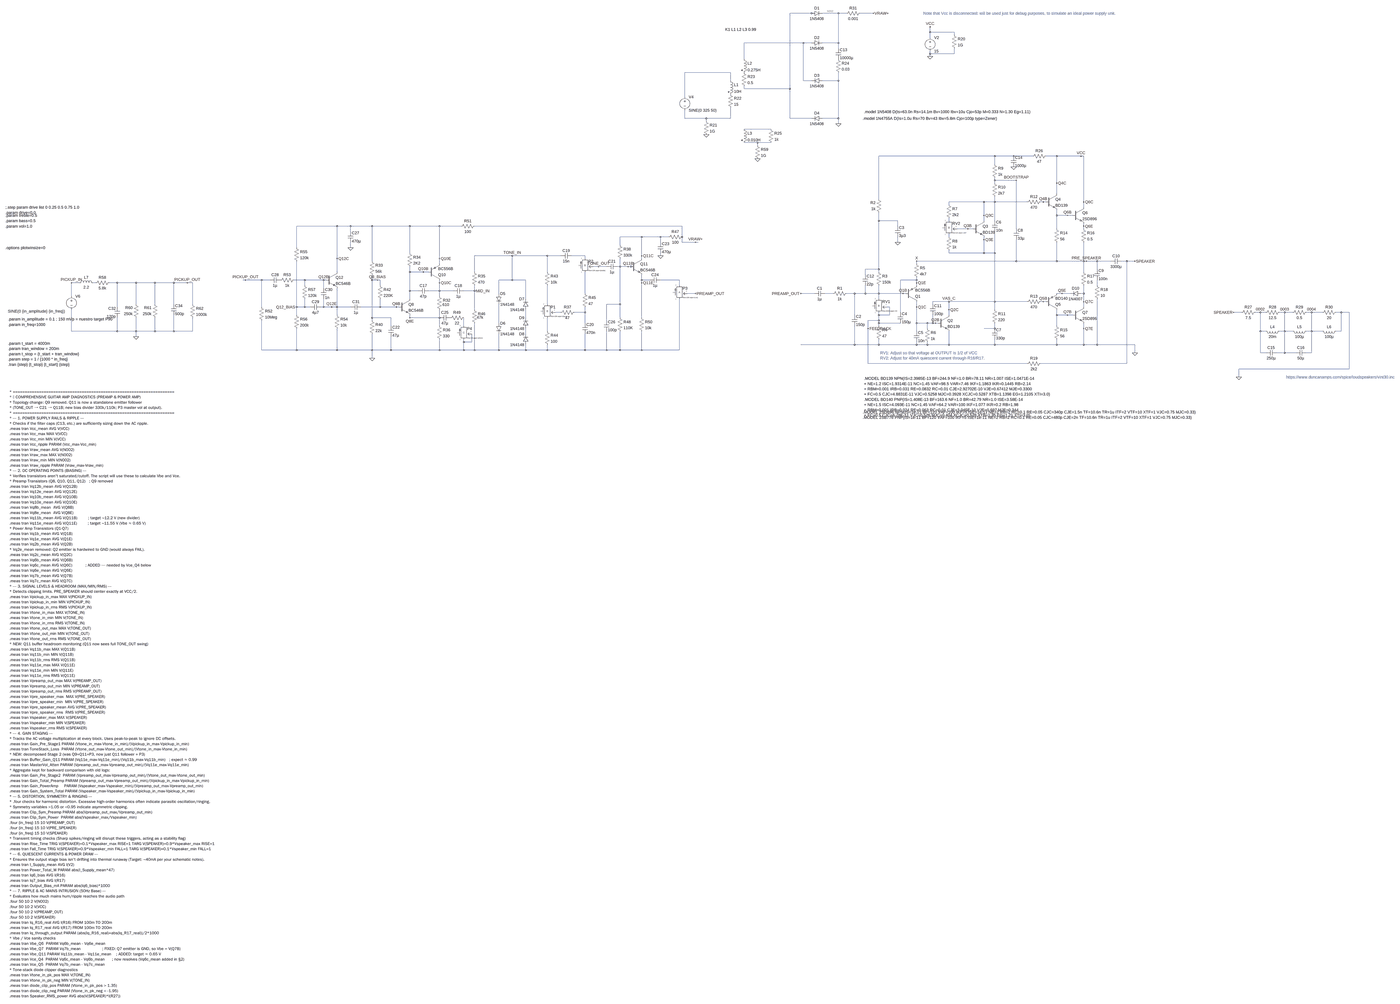
[diagram p0: schematic AudioAmpCompl-40W.asc, whole sheet]
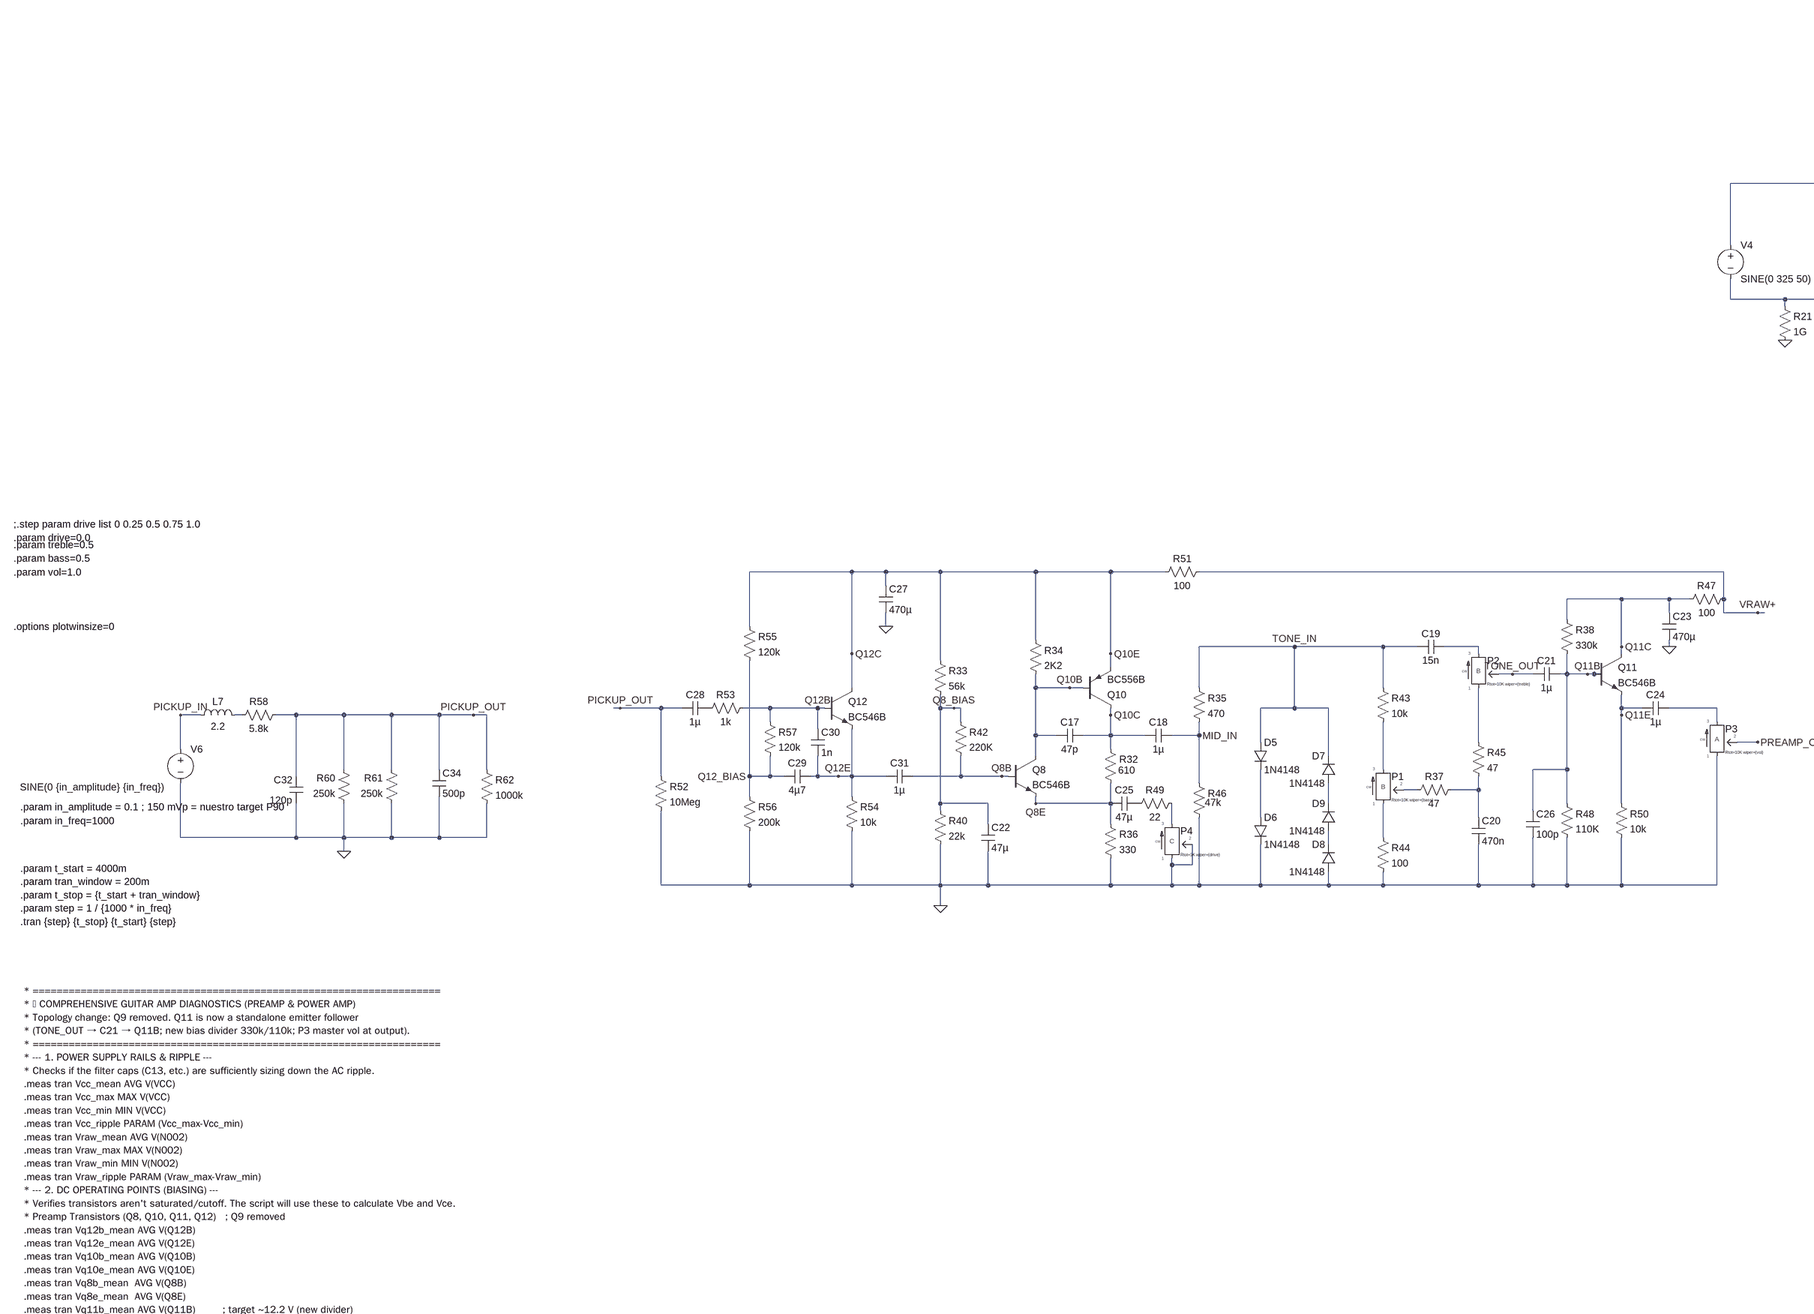
[diagram p1: schematic AudioAmpCompl-40W.asc, part, row 1 of 2, column 1 of 2]
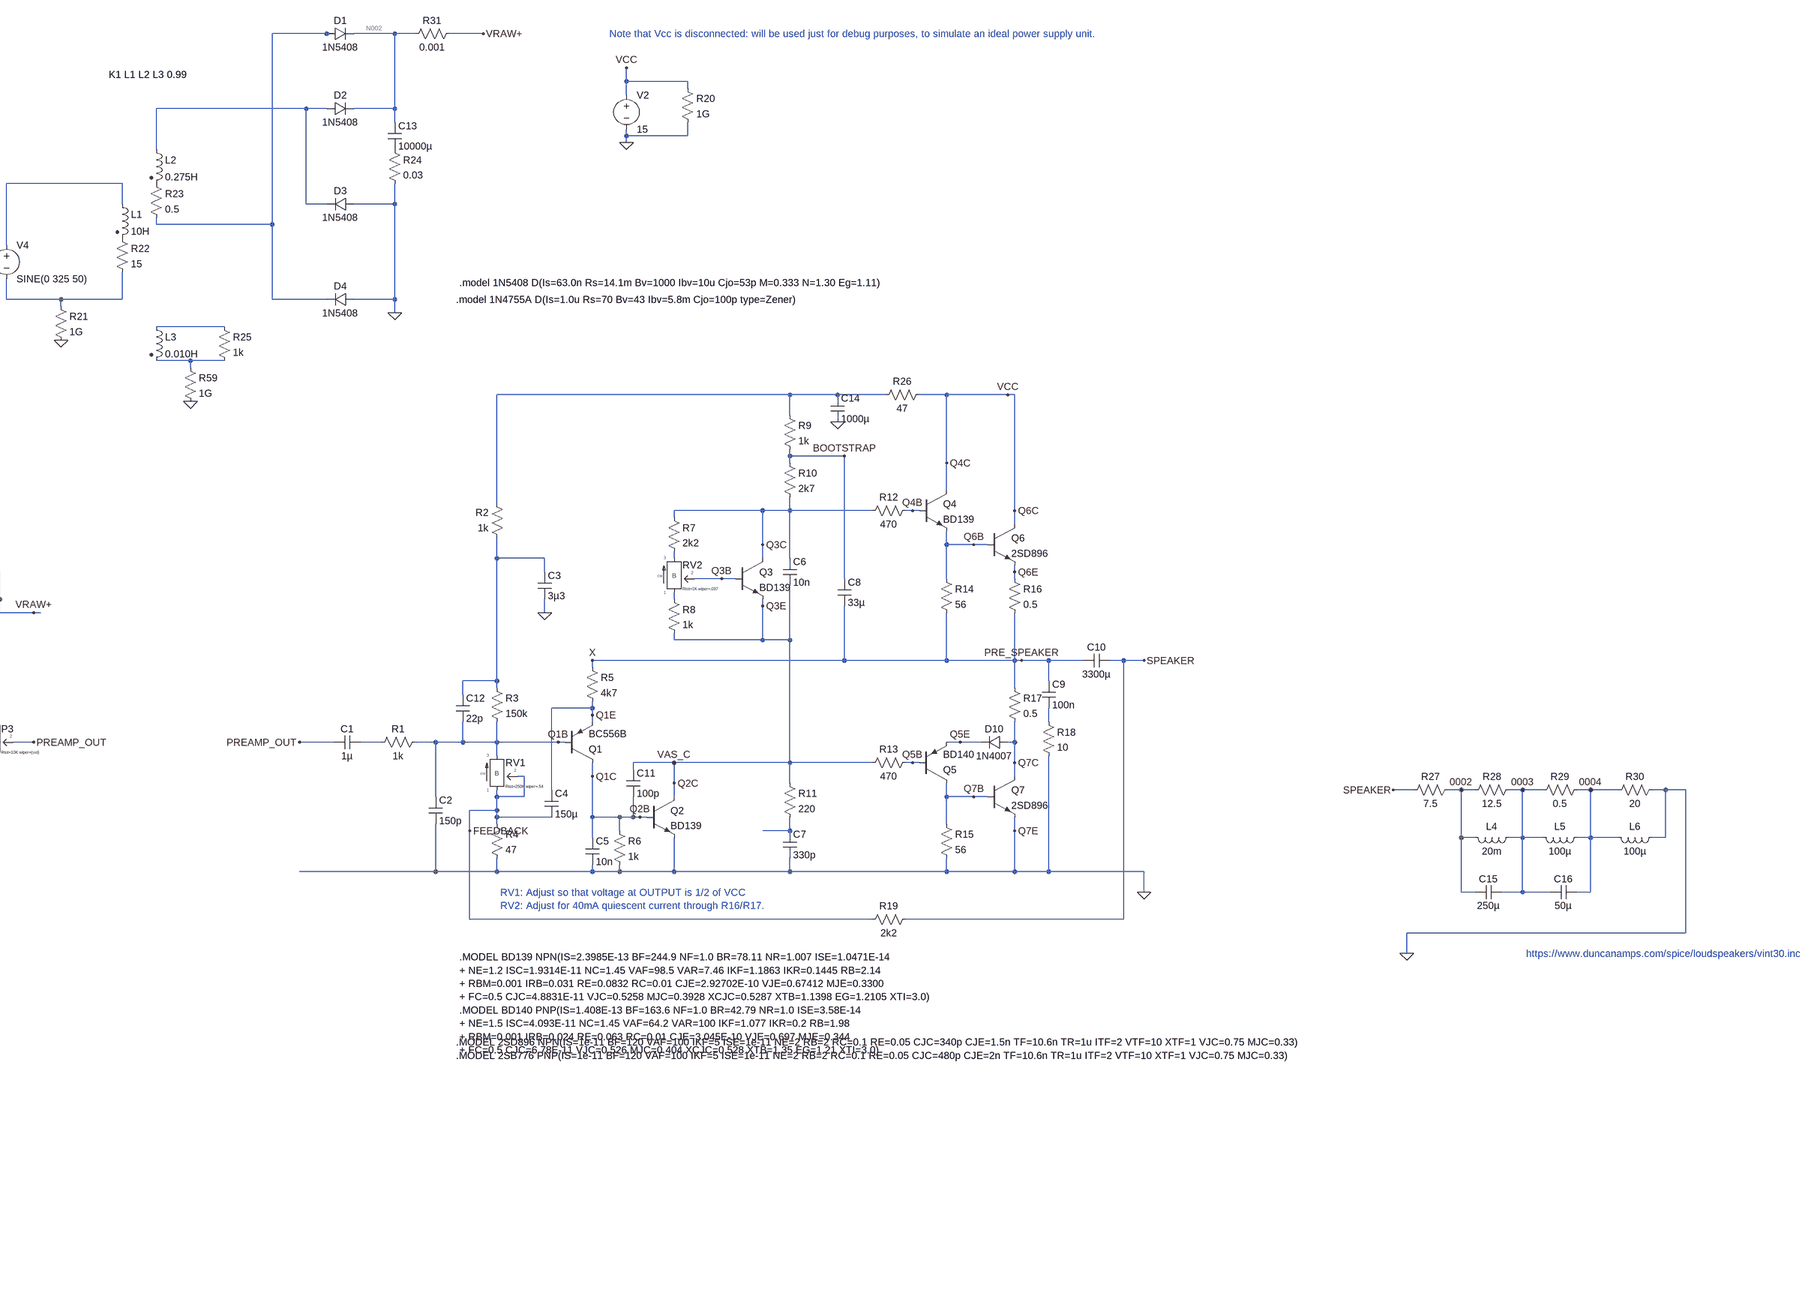
[diagram p2: schematic AudioAmpCompl-40W.asc, part, row 1 of 2, column 2 of 2]
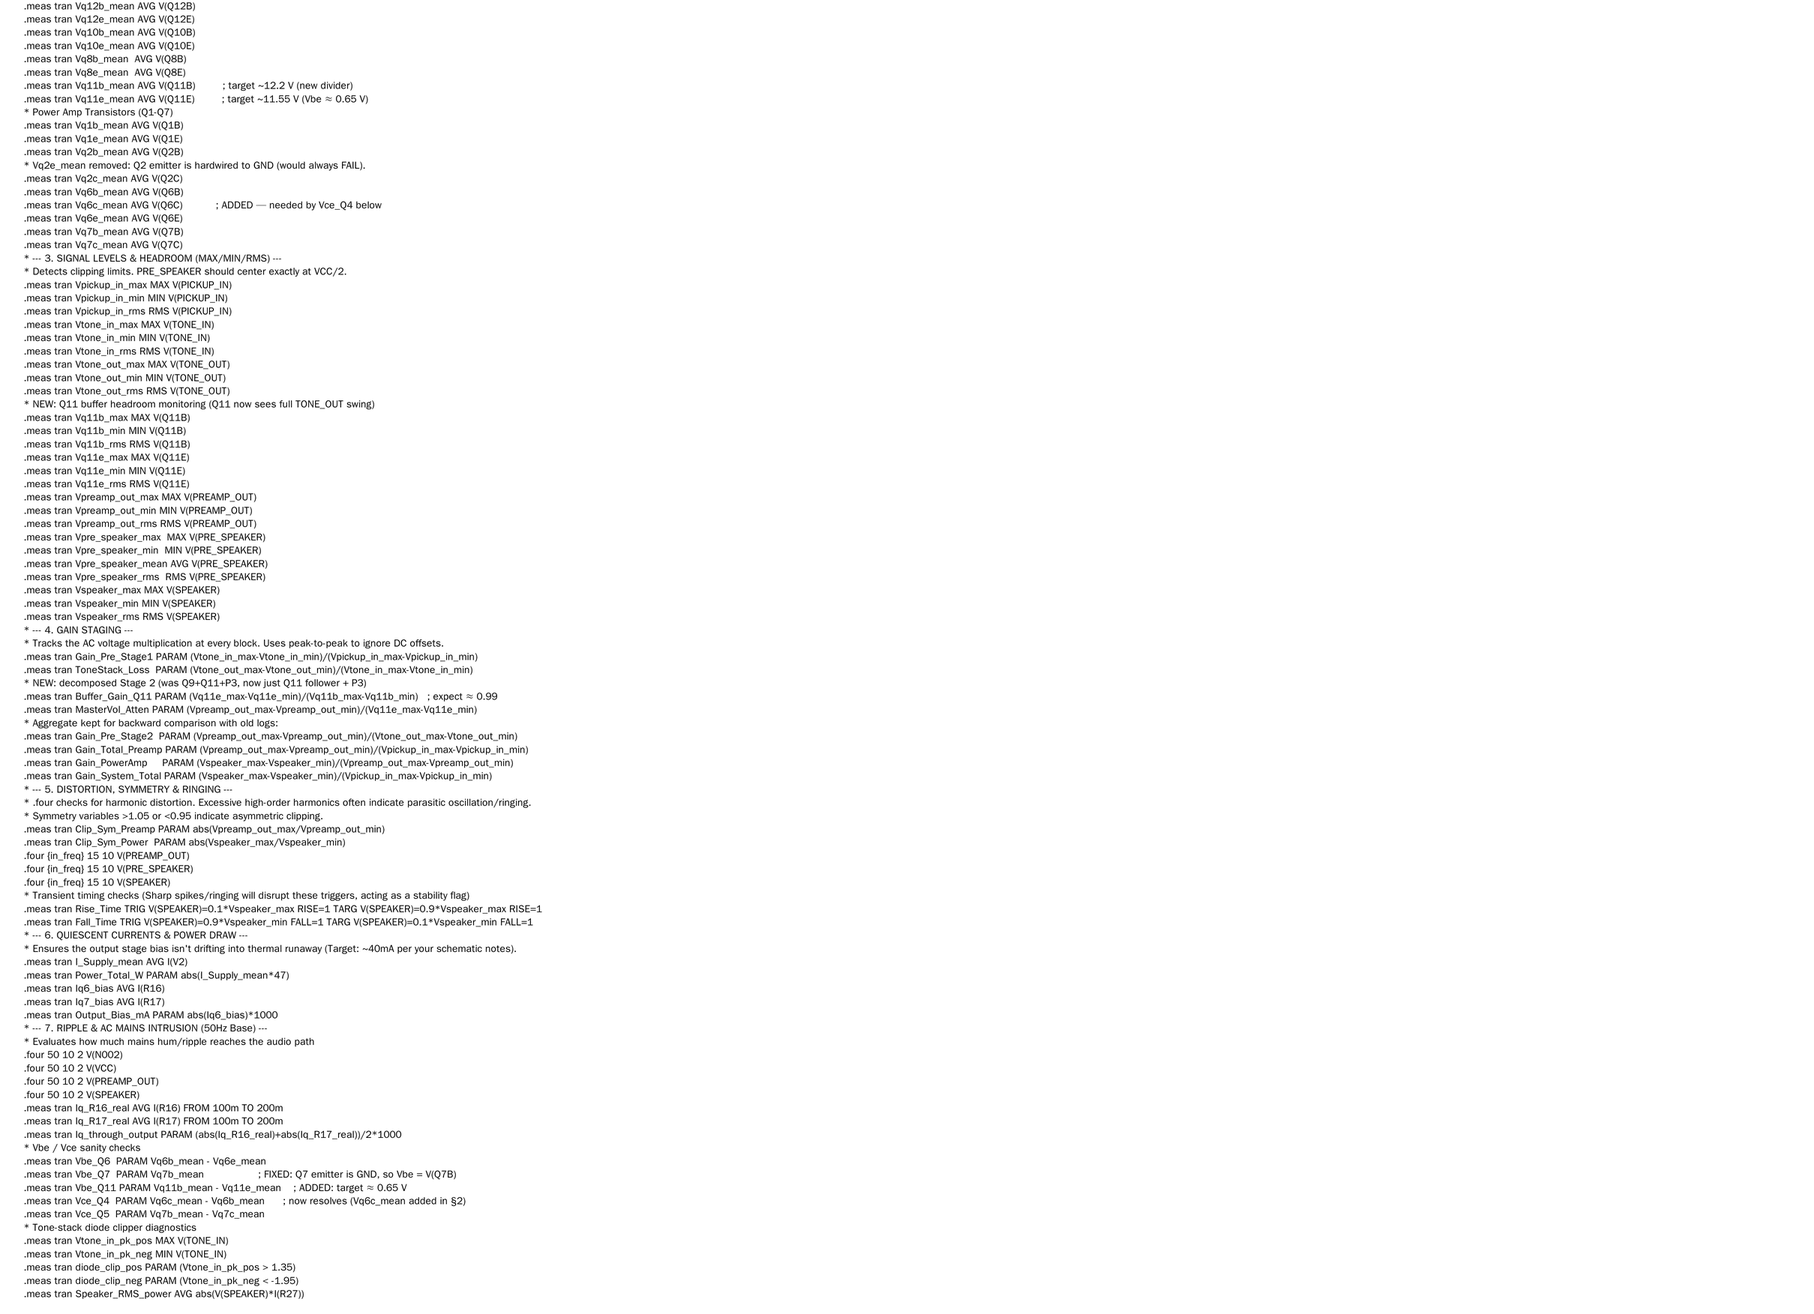
[diagram p3: schematic AudioAmpCompl-40W.asc, part, row 2 of 2, column 1 of 2]
AudioAmpCompl-40W.asc, the LTspice schematic file:
Version 4
SHEET 1 6900 5928
WIRE 3408 1136 3280 1136
WIRE 3424 1136 3408 1136
WIRE 3568 1136 3472 1136
WIRE 3616 1136 3568 1136
WIRE 3776 1136 3696 1136
WIRE 4112 1248 4112 1216
WIRE 4256 1248 4112 1248
WIRE 4256 1264 4256 1248
WIRE 4112 1280 4112 1248
WIRE 3360 1312 3008 1312
WIRE 3408 1312 3360 1312
WIRE 3568 1312 3568 1136
WIRE 3568 1312 3472 1312
WIRE 3568 1344 3568 1312
WIRE 4112 1376 4112 1360
WIRE 4256 1376 4256 1344
WIRE 4256 1376 4112 1376
WIRE 4112 1392 4112 1376
WIRE 3008 1408 3008 1312
WIRE 2928 1488 2656 1488
WIRE 2928 1536 2928 1488
WIRE 3360 1536 3360 1312
WIRE 3408 1536 3360 1536
WIRE 3568 1536 3568 1488
WIRE 3568 1536 3472 1536
WIRE 3008 1584 3008 1568
WIRE 3280 1584 3280 1136
WIRE 3280 1584 3008 1584
WIRE 2656 1632 2656 1488
WIRE 2656 1760 2656 1712
WIRE 2784 1760 2656 1760
WIRE 2928 1760 2928 1696
WIRE 2928 1760 2784 1760
WIRE 3280 1760 3280 1584
WIRE 3408 1760 3280 1760
WIRE 3568 1760 3568 1536
WIRE 3568 1760 3472 1760
WIRE 2784 1776 2784 1760
WIRE 3568 1792 3568 1760
WIRE 3168 1824 3008 1824
WIRE 3088 1904 3008 1904
WIRE 3168 1904 3088 1904
WIRE 3088 1920 3088 1904
WIRE 4496 1984 3808 1984
WIRE 4608 1984 4496 1984
WIRE 4720 1984 4608 1984
WIRE 4864 1984 4800 1984
WIRE 5008 1984 4864 1984
WIRE 5024 1984 5008 1984
WIRE 4496 2032 4496 1984
WIRE 4496 2128 4496 2112
WIRE 4624 2128 4496 2128
WIRE 4496 2144 4496 2128
WIRE 4864 2144 4864 1984
WIRE 4864 2208 4864 2144
WIRE 3808 2240 3808 1984
WIRE 4432 2256 4224 2256
WIRE 4496 2256 4496 2224
WIRE 4496 2256 4432 2256
WIRE 4688 2256 4496 2256
WIRE 4784 2256 4768 2256
WIRE 4800 2256 4784 2256
WIRE 5024 2256 5024 1984
WIRE 4224 2272 4224 2256
WIRE 5024 2288 5024 2256
WIRE 4432 2336 4432 2256
WIRE 4864 2336 4864 2304
WIRE 4928 2336 4864 2336
WIRE 4960 2336 4928 2336
WIRE 3808 2368 3808 2320
WIRE 3920 2368 3808 2368
WIRE 4224 2368 4224 2352
WIRE 4432 2368 4432 2336
WIRE 4496 2368 4496 2256
WIRE 592 2400 352 2400
WIRE 672 2400 592 2400
WIRE 800 2400 672 2400
WIRE 1024 2400 800 2400
WIRE 1200 2400 1024 2400
WIRE 1328 2400 1200 2400
WIRE 2640 2400 1408 2400
WIRE 3920 2400 3920 2368
WIRE 5024 2400 5024 2384
WIRE 4336 2416 4272 2416
WIRE 4368 2416 4336 2416
WIRE 4624 2416 4624 2128
WIRE 4864 2416 4864 2336
WIRE 5024 2416 5024 2400
WIRE 672 2432 672 2400
WIRE 2400 2464 2272 2464
WIRE 2512 2464 2400 2464
WIRE 2560 2464 2512 2464
WIRE 2640 2464 2640 2400
WIRE 4224 2464 4224 2448
WIRE 4432 2480 4432 2464
WIRE 2512 2496 2512 2464
WIRE 2640 2496 2640 2464
WIRE 2720 2496 2640 2496
WIRE 2736 2496 2720 2496
WIRE 3920 2496 3920 2464
WIRE 2272 2512 2272 2464
WIRE 352 2528 352 2400
WIRE 672 2528 672 2496
WIRE 1024 2560 1024 2400
WIRE 4224 2560 4224 2544
WIRE 4432 2560 4432 2480
WIRE 4432 2560 4224 2560
WIRE 4496 2560 4496 2432
WIRE 4496 2560 4432 2560
WIRE 1632 2576 1408 2576
WIRE 1840 2576 1632 2576
WIRE 1920 2576 1840 2576
WIRE 2064 2576 1984 2576
WIRE 2400 2576 2400 2464
WIRE 2512 2576 2512 2560
WIRE 592 2592 592 2400
WIRE 1200 2592 1200 2400
WIRE 2064 2592 2064 2576
WIRE 2400 2592 2400 2576
WIRE 800 2608 800 2400
WIRE 4624 2608 4624 2480
WIRE 4624 2608 4032 2608
WIRE 4864 2608 4864 2496
WIRE 4864 2608 4624 2608
WIRE 5024 2608 5024 2496
WIRE 5024 2608 4864 2608
WIRE 5040 2608 5024 2608
WIRE 5104 2608 5040 2608
WIRE 5184 2608 5104 2608
WIRE 5280 2608 5248 2608
WIRE 5328 2608 5280 2608
WIRE 1200 2624 1200 2592
WIRE 4032 2624 4032 2608
WIRE 2144 2640 2112 2640
WIRE 2192 2640 2144 2640
WIRE 2272 2640 2272 2592
WIRE 2272 2640 2256 2640
WIRE 2320 2640 2272 2640
WIRE 2336 2640 2320 2640
WIRE 2352 2640 2336 2640
WIRE 3808 2656 3808 2368
WIRE 3808 2656 3728 2656
WIRE 5104 2656 5104 2608
WIRE 592 2672 592 2592
WIRE 1024 2672 1024 2640
WIRE 1104 2672 1024 2672
WIRE 1136 2672 1104 2672
WIRE 1408 2672 1408 2576
WIRE 1840 2672 1840 2576
WIRE 3808 2672 3808 2656
WIRE 5024 2672 5024 2608
WIRE 3728 2688 3728 2656
WIRE 48 2720 32 2720
WIRE 144 2720 48 2720
WIRE 192 2720 144 2720
WIRE 400 2720 336 2720
WIRE 512 2720 400 2720
WIRE 528 2720 512 2720
WIRE 800 2720 800 2688
WIRE 832 2720 800 2720
WIRE 848 2720 832 2720
WIRE 1632 2720 1632 2576
WIRE 1632 2720 1552 2720
WIRE 1712 2720 1632 2720
WIRE 2400 2720 2400 2688
WIRE 2448 2720 2400 2720
WIRE 2624 2720 2512 2720
WIRE 4032 2720 4032 2704
WIRE 4032 2720 3936 2720
WIRE -944 2736 -992 2736
WIRE -848 2736 -864 2736
WIRE -720 2736 -768 2736
WIRE -608 2736 -720 2736
WIRE -496 2736 -608 2736
WIRE -384 2736 -496 2736
WIRE -304 2736 -384 2736
WIRE -272 2736 -304 2736
WIRE 1200 2736 1200 2720
WIRE 2400 2736 2400 2720
WIRE 4032 2736 4032 2720
WIRE 400 2752 400 2720
WIRE 848 2752 848 2720
WIRE 2624 2752 2624 2720
WIRE 4032 2752 4032 2736
WIRE 5104 2752 5104 2720
WIRE 512 2768 512 2720
WIRE 1024 2784 1024 2672
WIRE 1072 2784 1024 2784
WIRE 1200 2784 1200 2736
WIRE 1200 2784 1136 2784
WIRE 1280 2784 1200 2784
WIRE 1408 2784 1408 2752
WIRE 1408 2784 1344 2784
WIRE 1552 2800 1552 2720
WIRE 2064 2800 2064 2672
WIRE 2720 2800 2672 2800
WIRE 3424 2800 3344 2800
WIRE 3536 2800 3488 2800
WIRE 3664 2800 3616 2800
WIRE 3728 2800 3728 2752
WIRE 3728 2800 3664 2800
WIRE 3808 2800 3808 2752
WIRE 3808 2800 3728 2800
WIRE 3952 2800 3808 2800
WIRE 3968 2800 3952 2800
WIRE 4896 2800 4864 2800
WIRE 4944 2800 4896 2800
WIRE 5024 2800 5024 2752
WIRE 5024 2800 5008 2800
WIRE -992 2816 -992 2736
WIRE 1200 2816 1200 2784
WIRE 1024 2832 1024 2784
WIRE 1712 2832 1712 2720
WIRE 3808 2832 3808 2800
WIRE 4224 2848 4128 2848
WIRE 4496 2848 4496 2560
WIRE 4496 2848 4224 2848
WIRE 4688 2848 4496 2848
WIRE 4784 2848 4768 2848
WIRE 4800 2848 4784 2848
WIRE 5024 2848 5024 2800
WIRE -608 2864 -608 2736
WIRE -496 2864 -496 2736
WIRE -384 2864 -384 2736
WIRE -272 2864 -272 2736
WIRE 1840 2864 1840 2752
WIRE 2272 2864 2272 2640
WIRE 2272 2864 2192 2864
WIRE 4128 2864 4128 2848
WIRE -720 2880 -720 2736
WIRE 144 2880 144 2720
WIRE 352 2880 352 2608
WIRE 400 2880 400 2832
WIRE 400 2880 352 2880
WIRE 432 2880 400 2880
WIRE 512 2880 512 2832
WIRE 512 2880 496 2880
WIRE 560 2880 512 2880
WIRE 592 2880 592 2768
WIRE 592 2880 560 2880
WIRE 672 2880 592 2880
WIRE 848 2880 848 2832
WIRE 848 2880 736 2880
WIRE 944 2880 848 2880
WIRE 960 2880 944 2880
WIRE 3872 2880 3856 2880
WIRE 4032 2880 4032 2848
WIRE 5024 2880 5024 2848
WIRE 1408 2896 1408 2784
WIRE 4224 2896 4224 2848
WIRE 4496 2896 4496 2848
WIRE 1920 2912 1888 2912
WIRE 2064 2912 2064 2880
WIRE 2064 2912 2000 2912
WIRE 3936 2912 3936 2720
WIRE 5968 2912 5920 2912
WIRE 6080 2912 6048 2912
WIRE 6112 2912 6080 2912
WIRE 6224 2912 6192 2912
WIRE 6272 2912 6224 2912
WIRE 6384 2912 6352 2912
WIRE 6448 2912 6384 2912
WIRE 6560 2912 6528 2912
WIRE 6608 2912 6560 2912
WIRE 352 2928 352 2880
WIRE 592 2928 592 2880
WIRE 3664 2928 3664 2800
WIRE 3808 2928 3808 2912
WIRE 3872 2928 3872 2880
WIRE 3872 2928 3808 2928
WIRE 4224 2928 4224 2896
WIRE 4864 2928 4864 2896
WIRE 4928 2928 4864 2928
WIRE 4960 2928 4928 2928
WIRE 800 2944 800 2720
WIRE 912 2944 800 2944
WIRE 1024 2944 1024 2928
WIRE 1200 2944 1200 2896
WIRE 1200 2944 1024 2944
WIRE 1712 2944 1712 2896
WIRE 2272 2944 2272 2864
WIRE 2400 2944 2400 2736
WIRE 800 2960 800 2944
WIRE 2192 2960 2192 2864
WIRE 3808 2960 3808 2928
WIRE 3808 2960 3744 2960
WIRE 1552 2976 1552 2864
WIRE 2064 2976 2064 2912
WIRE 3808 2976 3808 2960
WIRE 3936 2976 3808 2976
WIRE 4032 2976 4032 2880
WIRE 4096 2976 4032 2976
WIRE 4128 2976 4128 2928
WIRE 4128 2976 4096 2976
WIRE 4144 2976 4128 2976
WIRE 4160 2976 4144 2976
WIRE 912 2992 912 2944
WIRE 1200 2992 1200 2944
WIRE 1344 2992 1344 2944
WIRE 3808 2992 3808 2976
WIRE 4864 2992 4864 2928
WIRE 3744 3008 3744 2960
WIRE 4096 3008 4096 2976
WIRE 4496 3008 4496 2976
WIRE 4496 3008 4432 3008
WIRE 5024 3008 5024 2976
WIRE -992 3024 -992 2896
WIRE -720 3024 -720 2944
WIRE -720 3024 -992 3024
WIRE -608 3024 -608 2944
WIRE -608 3024 -720 3024
WIRE -496 3024 -496 2944
WIRE -496 3024 -608 3024
WIRE -384 3024 -384 2928
WIRE -384 3024 -496 3024
WIRE -272 3024 -272 2944
WIRE -272 3024 -384 3024
WIRE 1840 3024 1840 2944
WIRE 4032 3024 4032 2976
WIRE 6080 3024 6080 2912
WIRE 6112 3024 6080 3024
WIRE 6224 3024 6224 2912
WIRE 6224 3024 6192 3024
WIRE 6272 3024 6224 3024
WIRE 6384 3024 6384 2912
WIRE 6384 3024 6352 3024
WIRE 6448 3024 6384 3024
WIRE 6560 3024 6560 2912
WIRE 6560 3024 6528 3024
WIRE 1712 3040 1712 3008
WIRE -608 3056 -608 3024
WIRE 1344 3088 1344 3072
WIRE 1392 3088 1392 3040
WIRE 1392 3088 1344 3088
WIRE 3664 3104 3664 2992
WIRE 3664 3104 3344 3104
WIRE 3808 3104 3808 3072
WIRE 3808 3104 3664 3104
WIRE 4032 3104 4032 3088
WIRE 4032 3104 3808 3104
WIRE 4096 3104 4096 3088
WIRE 4096 3104 4032 3104
WIRE 4224 3104 4224 3024
WIRE 4224 3104 4096 3104
WIRE 4496 3104 4496 3072
WIRE 4496 3104 4224 3104
WIRE 4864 3104 4864 3072
WIRE 4864 3104 4496 3104
WIRE 5024 3104 5024 3008
WIRE 5024 3104 4864 3104
WIRE 5104 3104 5104 2832
WIRE 5104 3104 5024 3104
WIRE 5328 3104 5104 3104
WIRE 144 3136 144 2960
WIRE 352 3136 352 3008
WIRE 352 3136 144 3136
WIRE 592 3136 592 3008
WIRE 592 3136 352 3136
WIRE 800 3136 800 3040
WIRE 800 3136 592 3136
WIRE 912 3136 912 3056
WIRE 912 3136 800 3136
WIRE 1200 3136 1200 3072
WIRE 1200 3136 912 3136
WIRE 1344 3136 1344 3088
WIRE 1344 3136 1200 3136
WIRE 1408 3136 1408 2976
WIRE 1408 3136 1344 3136
WIRE 1552 3136 1552 3040
WIRE 1552 3136 1408 3136
WIRE 1712 3136 1712 3104
WIRE 1712 3136 1552 3136
WIRE 1840 3136 1840 3104
WIRE 1840 3136 1712 3136
WIRE 2064 3136 2064 3040
WIRE 2064 3136 1840 3136
WIRE 2192 3136 2192 3024
WIRE 2192 3136 2064 3136
WIRE 2272 3136 2272 3024
WIRE 2272 3136 2192 3136
WIRE 2400 3136 2400 3024
WIRE 2400 3136 2272 3136
WIRE 2624 3136 2624 2832
WIRE 2624 3136 2400 3136
WIRE 5328 3152 5328 3104
WIRE 6080 3152 6080 3024
WIRE 6112 3152 6080 3152
WIRE 6224 3152 6224 3024
WIRE 6224 3152 6176 3152
WIRE 6288 3152 6224 3152
WIRE 6384 3152 6384 3024
WIRE 6384 3152 6352 3152
WIRE 800 3184 800 3136
WIRE 3744 3216 3744 3008
WIRE 4688 3216 3744 3216
WIRE 5280 3216 5280 2608
WIRE 5280 3216 4768 3216
WIRE 6608 3248 6608 2912
WIRE 6608 3248 5952 3248
WIRE 5952 3296 5952 3248
FLAG 5328 3152 0
FLAG 3920 2496 0
FLAG 4112 1392 0
FLAG 4112 1216 VCC
FLAG 5328 2608 SPEAKER
FLAG 5040 2608 PRE_SPEAKER
FLAG 3344 2800 PREAMP_OUT
FLAG 4624 2128 BOOTSTRAP
FLAG 4224 2848 VAS_C
FLAG 4032 2608 X
FLAG 5008 1984 VCC
FLAG 3568 1792 0
FLAG 4608 2048 0
FLAG 6080 2912 0002
FLAG 6224 2912 0003
FLAG 6384 2912 0004
FLAG 5952 3296 0
FLAG 5920 2912 SPEAKER
FLAG 3776 1136 VRAW+
FLAG 944 2880 Q8B
FLAG 1024 2944 Q8E
FLAG 1200 2736 Q10C
FLAG 1200 2592 Q10E
FLAG 800 3184 0
FLAG -992 2736 PICKUP_IN
FLAG 2512 2576 0
FLAG 1632 2576 TONE_IN
FLAG 1408 2784 MID_IN
FLAG 2400 2736 Q11E
FLAG 2400 2576 Q11C
FLAG 672 2528 0
FLAG 512 2720 Q12B
FLAG 592 2592 Q12C
FLAG 352 2880 Q12_BIAS
FLAG 560 2880 Q12E
FLAG 2144 2640 TONE_OUT
FLAG 2720 2800 PREAMP_OUT
FLAG 2720 2496 VRAW+
FLAG -304 2736 PICKUP_OUT
FLAG 48 2720 PICKUP_OUT
FLAG -608 3056 0
FLAG 1104 2672 Q10B
FLAG 2320 2640 Q11B
FLAG 4144 2976 Q2B
FLAG 4224 2896 Q2C
FLAG 4032 2736 Q1E
FLAG 3952 2800 Q1B
FLAG 4032 2880 Q1C
FLAG 4432 2480 Q3E
FLAG 4336 2416 Q3B
FLAG 4432 2336 Q3C
FLAG 4784 2256 Q4B
FLAG 4864 2144 Q4C
FLAG 5024 2256 Q6C
FLAG 4928 2336 Q6B
FLAG 5024 2400 Q6E
FLAG 5024 2848 Q7C
FLAG 4928 2928 Q7B
FLAG 5024 3008 Q7E
FLAG 4896 2800 Q5E
FLAG 4784 2848 Q5B
FLAG 832 2720 Q8_BIAS
FLAG 3744 3008 FEEDBACK
FLAG 2784 1856 0
FLAG 3088 2000 0
DATAFLAG 800 2720 "round($*100)/100"
DATAFLAG 848 2880 "round($*100)/100"
DATAFLAG 1200 2784 "round($*100)/100"
DATAFLAG 1024 2672 "round($*100)/100"
DATAFLAG 1104 2944 "round($*100)/100"
DATAFLAG 1360 2784 "round($*100)/100"
DATAFLAG 2416 2464 "round($*100)/100"
DATAFLAG 1248 2400 "round($*100)/100"
DATAFLAG 448 2720 "round($*100)/100"
DATAFLAG 592 2832 "round($*100)/100"
DATAFLAG 352 2800 "round($*100)/100"
DATAFLAG 2272 2720 "round($*100)/100"
DATAFLAG 2400 2816 "round($*100)/100"
DATAFLAG 3888 2368 "round($*100)/100"
DATAFLAG 3808 2000 "round($*100)/100"
DATAFLAG 3888 2800 "round($*100)/100"
DATAFLAG 3872 2976 "round($*100)/100"
DATAFLAG 4496 2128 "round($*100)/100"
DATAFLAG 4416 2256 "round($*100)/100"
DATAFLAG 4336 2560 "round($*100)/100"
DATAFLAG 4560 2608 "round($*100)/100"
DATAFLAG 4560 2848 "round($*100)/100"
DATAFLAG 4432 3008 "round($*100)/100"
DATAFLAG 4864 2384 "round($*100)/100"
DATAFLAG 4864 2544 "round($*100)/100"
DATAFLAG 5024 2544 "round($*100)/100"
DATAFLAG 5024 2768 "round($*100)/100"
SYMBOL npn 4960 2288 R0
SYMATTR InstName Q6
SYMATTR Value 2SD896
SYMBOL npn 4960 2880 R0
SYMATTR InstName Q7
SYMATTR Value 2SD896
SYMBOL res 5008 2400 R0
SYMATTR InstName R16
SYMATTR Value 0.5
SYMBOL res 5008 2656 R0
SYMATTR InstName R17
SYMATTR Value 0.5
SYMBOL npn 4800 2208 R0
SYMATTR InstName Q4
SYMATTR Value BD139
SYMBOL res 4848 2400 R0
SYMATTR InstName R14
SYMATTR Value 56
SYMBOL res 4848 2976 R0
SYMATTR InstName R15
SYMATTR Value 56
SYMBOL pnp 4800 2896 M180
SYMATTR InstName Q5
SYMATTR Value BD140
SYMBOL res 4784 2240 R90
WINDOW 0 0 56 VBottom 2
WINDOW 3 32 56 VTop 2
SYMATTR InstName R12
SYMATTR Value 470
SYMBOL res 4784 2832 R90
WINDOW 0 0 56 VBottom 2
WINDOW 3 32 56 VTop 2
SYMATTR InstName R13
SYMATTR Value 470
SYMBOL npn 4368 2368 R0
SYMATTR InstName Q3
SYMATTR Value BD139
SYMBOL res 4208 2256 R0
SYMATTR InstName R7
SYMATTR Value 2k2
SYMBOL res 4208 2448 R0
SYMATTR InstName R8
SYMATTR Value 1k
SYMBOL cap 4480 2368 R0
SYMATTR InstName C6
SYMATTR Value 10n
SYMBOL res 4480 2128 R0
SYMATTR InstName R10
SYMATTR Value 2k7
SYMBOL res 4480 2016 R0
SYMATTR InstName R9
SYMATTR Value 1k
SYMBOL cap 4608 2416 R0
SYMATTR InstName C8
SYMATTR Value 33µ
SYMBOL cap 5088 2656 R0
SYMATTR InstName C9
SYMATTR Value 100n
SYMBOL res 5088 2736 R0
SYMATTR InstName R18
SYMATTR Value 10
SYMBOL res 4480 2880 R0
SYMATTR InstName R11
SYMATTR Value 220
SYMBOL cap 4480 3008 R0
SYMATTR InstName C7
SYMATTR Value 330p
SYMBOL npn 4160 2928 R0
SYMATTR InstName Q2
SYMATTR Value BD139
SYMBOL res 4080 2992 R0
SYMATTR InstName R6
SYMATTR Value 1k
SYMBOL cap 4016 3024 R0
SYMATTR InstName C5
SYMATTR Value 10n
SYMBOL pnp 3968 2848 M180
SYMATTR InstName Q1
SYMATTR Value BC556B
SYMBOL res 4016 2608 R0
SYMATTR InstName R5
SYMATTR Value 4k7
SYMBOL res 3824 2336 R180
WINDOW 0 36 76 Left 2
WINDOW 3 36 40 Left 2
SYMATTR InstName R2
SYMATTR Value 1k
SYMBOL cap 3904 2400 R0
SYMATTR InstName C3
SYMATTR Value 3µ3
SYMBOL res 3792 2656 R0
SYMATTR InstName R3
SYMATTR Value 150k
SYMBOL res 3792 2976 R0
SYMATTR InstName R4
SYMATTR Value 47
SYMBOL cap 5248 2592 R90
WINDOW 0 0 32 VBottom 2
WINDOW 3 32 32 VTop 2
SYMATTR InstName C10
SYMATTR Value 3300µ
SYMBOL cap 3920 2912 R0
SYMATTR InstName C4
SYMATTR Value 150µ
SYMBOL voltage 4112 1264 R0
WINDOW 123 0 0 Left 0
WINDOW 39 0 0 Left 0
SYMATTR InstName V2
SYMATTR Value 15
SYMBOL cap 3648 2928 R0
SYMATTR InstName C2
SYMATTR Value 150p
SYMBOL cap 3488 2784 R90
WINDOW 0 0 32 VBottom 2
WINDOW 3 32 32 VTop 2
SYMATTR InstName C1
SYMATTR Value 1µ
SYMBOL res 3632 2784 R90
WINDOW 0 0 56 VBottom 2
WINDOW 3 32 56 VTop 2
SYMATTR InstName R1
SYMATTR Value 1k
SYMBOL res 4784 3200 R90
WINDOW 0 0 56 VBottom 2
WINDOW 3 32 56 VTop 2
SYMATTR InstName R19
SYMATTR Value 2k2
SYMBOL Cap 3712 2688 R0
SYMATTR InstName C12
SYMATTR Value 22p
SYMBOL Cap 4112 2864 R0
SYMATTR InstName C11
SYMATTR Value 100p
SYMBOL voltage 2656 1616 R0
SYMATTR InstName V4
SYMATTR Value SINE(0 325 50)
SYMATTR SpiceLine Rser=0.1
SYMBOL ind2 2912 1520 R0
SYMATTR InstName L1
SYMATTR Value 10H
SYMATTR Type ind
SYMBOL ind2 2992 1392 R0
SYMATTR InstName L2
SYMATTR Value 0.275H
SYMATTR Type ind
SYMBOL ind2 2992 1808 R0
SYMATTR InstName L3
SYMATTR Value 0.010H
SYMATTR Type ind
SYMBOL Res 2912 1600 R0
SYMATTR InstName R22
SYMATTR Value 15
SYMBOL Res 2992 1472 R0
SYMATTR InstName R23
SYMATTR Value 0.5
SYMBOL Diode 3408 1152 R270
WINDOW 0 32 32 VTop 2
WINDOW 3 0 32 VBottom 2
SYMATTR InstName D1
SYMATTR Value 1N5408
SYMBOL Diode 3408 1328 R270
WINDOW 0 32 32 VTop 2
WINDOW 3 0 32 VBottom 2
SYMATTR InstName D2
SYMATTR Value 1N5408
SYMBOL Diode 3472 1520 R90
WINDOW 0 0 32 VBottom 2
WINDOW 3 32 32 VTop 2
SYMATTR InstName D3
SYMATTR Value 1N5408
SYMBOL Diode 3472 1744 R90
WINDOW 0 0 32 VBottom 2
WINDOW 3 32 32 VTop 2
SYMATTR InstName D4
SYMATTR Value 1N5408
SYMBOL Cap 3552 1344 R0
SYMATTR InstName C13
SYMATTR Value 10000µ
SYMBOL Res 3552 1392 R0
SYMATTR InstName R24
SYMATTR Value 0.03
SYMBOL Res 3152 1808 R0
SYMATTR InstName R25
SYMATTR Value 1k
SYMBOL Res 4816 1968 R90
WINDOW 0 0 56 VBottom 2
WINDOW 3 32 56 VTop 2
SYMATTR InstName R26
SYMATTR Value 47
SYMBOL Cap 4592 1984 R0
SYMATTR InstName C14
SYMATTR Value 1000µ
SYMBOL res 6064 2896 R90
WINDOW 0 0 56 VBottom 2
WINDOW 3 32 56 VTop 2
SYMATTR InstName R27
SYMATTR Value 7.5
SYMBOL res 6208 2896 R90
WINDOW 0 0 56 VBottom 2
WINDOW 3 32 56 VTop 2
SYMATTR InstName R28
SYMATTR Value 12.5
SYMBOL ind 6208 3008 R90
WINDOW 0 5 56 VBottom 2
WINDOW 3 32 56 VTop 2
SYMATTR InstName L4
SYMATTR Value 20m
SYMBOL cap 6176 3136 R90
WINDOW 0 0 32 VBottom 2
WINDOW 3 32 32 VTop 2
SYMATTR InstName C15
SYMATTR Value 250µ
SYMBOL res 6368 2896 R90
WINDOW 0 0 56 VBottom 2
WINDOW 3 32 56 VTop 2
SYMATTR InstName R29
SYMATTR Value 0.5
SYMBOL cap 6352 3136 R90
WINDOW 0 0 32 VBottom 2
WINDOW 3 32 32 VTop 2
SYMATTR InstName C16
SYMATTR Value 50µ
SYMBOL ind 6368 3008 R90
WINDOW 0 5 56 VBottom 2
WINDOW 3 32 56 VTop 2
SYMATTR InstName L5
SYMATTR Value 100µ
SYMBOL res 6544 2896 R90
WINDOW 0 0 56 VBottom 2
WINDOW 3 32 56 VTop 2
SYMATTR InstName R30
SYMATTR Value 20
SYMBOL ind 6544 3008 R90
WINDOW 0 5 56 VBottom 2
WINDOW 3 32 56 VTop 2
SYMATTR InstName L6
SYMATTR Value 100µ
SYMBOL Res 3712 1120 R90
WINDOW 0 0 56 VBottom 2
WINDOW 3 32 56 VTop 2
SYMATTR InstName R31
SYMATTR Value 0.001
SYMBOL npn 960 2832 R0
SYMATTR InstName Q8
SYMATTR Value BC546B
SYMBOL Cap 1136 2768 R90
WINDOW 0 0 32 VBottom 2
WINDOW 3 32 32 VTop 2
SYMATTR InstName C17
SYMATTR Value 47p
SYMBOL Cap 1344 2768 R90
WINDOW 0 0 32 VBottom 2
WINDOW 3 32 32 VTop 2
SYMATTR InstName C18
SYMATTR Value 1µ
SYMBOL Res 1184 2800 R0
WINDOW 3 34 65 Left 2
SYMATTR Value 610
SYMATTR InstName R32
SYMBOL Res 784 2592 R0
SYMATTR InstName R33
SYMATTR Value 56k
SYMBOL Res 1008 2544 R0
SYMATTR InstName R34
SYMATTR Value 2K2
SYMBOL Res 1392 2656 R0
SYMATTR InstName R35
SYMATTR Value 470
SYMBOL Res 1184 2976 R0
SYMATTR InstName R36
SYMATTR Value 330
SYMBOL Res 2016 2896 R90
WINDOW 0 0 56 VBottom 2
WINDOW 3 32 56 VTop 2
SYMATTR InstName R37
SYMATTR Value 47
SYMBOL Cap 1984 2560 R90
WINDOW 0 0 32 VBottom 2
WINDOW 3 32 32 VTop 2
SYMATTR InstName C19
SYMATTR Value 15n
SYMBOL Cap 2048 2976 R0
SYMATTR InstName C20
SYMATTR Value 470n
SYMBOL Cap 2256 2624 R90
WINDOW 0 0 32 VBottom 2
WINDOW 3 32 32 VTop 2
SYMATTR InstName C21
SYMATTR Value 1µ
SYMBOL Res 784 2944 R0
SYMATTR InstName R40
SYMATTR Value 22k
SYMBOL pnp 1136 2720 M180
SYMATTR InstName Q10
SYMATTR Value BC556B
SYMBOL Cap 896 2992 R0
SYMATTR InstName C22
SYMATTR Value 47µ
SYMBOL Res 832 2736 R0
SYMATTR InstName R42
SYMATTR Value 220K
SYMBOL Res 1824 2656 R0
SYMATTR InstName R43
SYMATTR Value 10k
SYMBOL Res 1824 3008 R0
SYMATTR InstName R44
SYMATTR Value 100
SYMBOL Res 2048 2784 R0
SYMATTR InstName R45
SYMATTR Value 47
SYMBOL Res 1392 2880 R0
WINDOW 3 29 61 Left 2
SYMATTR Value 47k
SYMATTR InstName R46
SYMBOL Res 2656 2448 R90
WINDOW 0 0 56 VBottom 2
WINDOW 3 32 56 VTop 2
SYMATTR InstName R47
SYMATTR Value 100
SYMBOL Cap 2496 2496 R0
SYMATTR InstName C23
SYMATTR Value 470µ
SYMBOL Voltage -992 2800 R0
WINDOW 39 0 0 Left 0
WINDOW 3 -377 105 Left 2
SYMATTR Value SINE(0 {in_amplitude} {in_freq})
SYMATTR InstName V6
SYMBOL Cap 1264 2928 R90
WINDOW 0 0 32 VBottom 2
WINDOW 3 32 32 VTop 2
SYMATTR InstName C25
SYMATTR Value 47µ
SYMBOL Res 1360 2928 R90
WINDOW 0 0 56 VBottom 2
WINDOW 3 32 56 VTop 2
SYMATTR InstName R49
SYMATTR Value 22
SYMBOL npn 2336 2592 R0
SYMATTR InstName Q11
SYMATTR Value BC546B
SYMBOL Res 2384 2928 R0
SYMATTR InstName R50
SYMATTR Value 10k
SYMBOL Res 1424 2384 R90
WINDOW 0 0 56 VBottom 2
WINDOW 3 32 56 VTop 2
SYMATTR InstName R51
SYMATTR Value 100
SYMBOL Cap 656 2432 R0
SYMATTR InstName C27
SYMATTR Value 470µ
SYMBOL npn 528 2672 R0
SYMATTR InstName Q12
SYMATTR Value BC546B
SYMBOL Res 128 2864 R0
SYMATTR InstName R52
SYMATTR Value 10Meg
SYMBOL Cap 256 2704 R90
WINDOW 0 0 32 VBottom 2
WINDOW 3 32 32 VTop 2
SYMATTR InstName C28
SYMATTR Value 1µ
SYMBOL Res 352 2704 R90
WINDOW 0 0 56 VBottom 2
WINDOW 3 32 56 VTop 2
SYMATTR InstName R53
SYMATTR Value 1k
SYMBOL Res 576 2912 R0
SYMATTR InstName R54
SYMATTR Value 10k
SYMBOL Res 336 2512 R0
SYMATTR InstName R55
SYMATTR Value 120k
SYMBOL Res 336 2912 R0
SYMATTR InstName R56
SYMATTR Value 200k
SYMBOL Res 384 2736 R0
SYMATTR InstName R57
SYMATTR Value 120k
SYMBOL Cap 496 2864 R90
WINDOW 0 0 32 VBottom 2
WINDOW 3 32 32 VTop 2
SYMATTR InstName C29
SYMATTR Value 4µ7
SYMBOL Cap 496 2768 R0
SYMATTR InstName C30
SYMATTR Value 1n
SYMBOL Cap 736 2864 R90
WINDOW 0 0 32 VBottom 2
WINDOW 3 32 32 VTop 2
SYMATTR InstName C31
SYMATTR Value 1µ
SYMBOL diode 1536 2800 R0
SYMATTR InstName D5
SYMATTR Value 1N4148
SYMBOL diode 1536 2976 R0
SYMATTR InstName D6
SYMATTR Value 1N4148
SYMBOL diode 1728 2896 R180
WINDOW 0 24 64 Left 2
WINDOW 3 24 0 Left 2
SYMATTR InstName D7
SYMATTR Value 1N4148
SYMBOL diode 1728 3104 R180
WINDOW 0 24 64 Left 2
WINDOW 3 24 0 Left 2
SYMATTR InstName D8
SYMATTR Value 1N4148
SYMBOL lin_pot 4208 2352 R0
WINDOW 0 36 32 Left 2
SYMATTR InstName RV2
SYMATTR Value Rtot=1K wiper=.037
SYMBOL lin_pot 3792 2816 R0
WINDOW 0 36 32 Left 2
SYMATTR InstName RV1
SYMATTR Value Rtot=250K wiper=.54
SYMBOL lin_pot 2048 2576 R0
WINDOW 0 36 32 Left 2
SYMATTR InstName P2
SYMATTR Value Rtot=10K wiper={treble}
SYMBOL lin_pot 1824 2848 R0
WINDOW 0 36 32 Left 2
SYMATTR InstName P1
SYMATTR Value Rtot=10K wiper={bass}
SYMBOL log_pot 2608 2736 R0
WINDOW 0 36 32 Left 2
SYMATTR InstName P3
SYMATTR Value Rtot=10K wiper={vol}
SYMBOL revlog_pot 1328 2976 R0
WINDOW 0 36 32 Left 2
SYMATTR InstName P4
SYMATTR Value Rtot=1K wiper={drive}
SYMBOL Diode 1728 3008 R180
WINDOW 0 24 64 Left 2
WINDOW 3 24 0 Left 2
SYMATTR InstName D9
SYMATTR Value 1N4148
SYMBOL Ind -960 2752 R270
WINDOW 0 32 56 VTop 2
WINDOW 3 5 56 VBottom 2
SYMATTR InstName L7
SYMATTR Value 2.2
SYMBOL Res -752 2720 R90
WINDOW 0 0 56 VBottom 2
WINDOW 3 32 56 VTop 2
SYMATTR InstName R58
SYMATTR Value 5.8k
SYMBOL Res -592 2960 R180
WINDOW 0 36 76 Left 2
WINDOW 3 36 40 Left 2
SYMATTR InstName R60
SYMATTR Value 250k
SYMBOL Res -480 2960 R180
WINDOW 0 36 76 Left 2
WINDOW 3 36 40 Left 2
SYMATTR InstName R61
SYMATTR Value 250k
SYMBOL Cap -400 2864 R0
SYMATTR InstName C34
SYMATTR Value 500p
SYMBOL Res -288 2848 R0
SYMATTR InstName R62
SYMATTR Value 1000k
SYMBOL Cap -704 2944 R180
WINDOW 0 24 56 Left 2
WINDOW 3 24 8 Left 2
SYMATTR InstName C32
SYMATTR Value 120p
SYMBOL Res 4240 1248 R0
SYMATTR InstName R20
SYMATTR Value 1G
SYMBOL Res 2768 1760 R0
SYMATTR InstName R21
SYMATTR Value 1G
SYMBOL Res 3072 1904 R0
SYMATTR InstName R59
SYMATTR Value 1G
SYMBOL Cap 2512 2704 R90
WINDOW 0 0 32 VBottom 2
WINDOW 3 32 32 VTop 2
SYMATTR InstName C24
SYMATTR Value 1µ
SYMBOL Res 2256 2496 R0
SYMATTR InstName R38
SYMATTR Value 330k
SYMBOL Res 2256 2928 R0
SYMATTR InstName R48
SYMATTR Value 110K
SYMBOL Cap 2176 2960 R0
SYMATTR InstName C26
SYMATTR Value 100p
SYMBOL diode 5008 2784 R90
WINDOW 0 0 32 VBottom 2
WINDOW 3 32 32 VTop 2
SYMATTR InstName D10
SYMATTR Value 1N4007
TEXT 3816 3152 Left 2 ;RV1: Adjust so that voltage at OUTPUT is 1/2 of VCC\nRV2: Adjust for 40mA quiescent current through R16/R17.
TEXT 3720 3304 Left 2 !.MODEL BD139 NPN(IS=2.3985E-13 BF=244.9 NF=1.0 BR=78.11 NR=1.007 ISE=1.0471E-14 \n+ NE=1.2 ISC=1.9314E-11 NC=1.45 VAF=98.5 VAR=7.46 IKF=1.1863 IKR=0.1445 RB=2.14 \n+ RBM=0.001 IRB=0.031 RE=0.0832 RC=0.01 CJE=2.92702E-10 VJE=0.67412 MJE=0.3300 \n+ FC=0.5 CJC=4.8831E-11 VJC=0.5258 MJC=0.3928 XCJC=0.5287 XTB=1.1398 EG=1.2105 XTI=3.0)\n.MODEL BD140 PNP(IS=1.408E-13 BF=163.6 NF=1.0 BR=42.79 NR=1.0 ISE=3.58E-14 \n+ NE=1.5 ISC=4.093E-11 NC=1.45 VAF=64.2 VAR=100 IKF=1.077 IKR=0.2 RB=1.98 \n+ RBM=0.001 IRB=0.024 RE=0.063 RC=0.01 CJE=3.045E-10 VJE=0.697 MJE=0.344 \n+ FC=0.5 CJC=6.78E-11 VJC=0.526 MJC=0.404 XCJC=0.528 XTB=1.35 EG=1.21 XTI=3.0)
TEXT 3712 3504 Left 2 !.MODEL 2SD896 NPN(IS=1e-11 BF=120 VAF=100 IKF=5 ISE=1e-11 NE=2 RB=2 RC=0.1 RE=0.05 CJC=340p CJE=1.5n TF=10.6n TR=1u ITF=2 VTF=10 XTF=1 VJC=0.75 MJC=0.33)\n.MODEL 2SB776 PNP(IS=1e-11 BF=120 VAF=100 IKF=5 ISE=1e-11 NE=2 RB=2 RC=0.1 RE=0.05 CJC=480p CJE=2n TF=10.6n TR=1u ITF=2 VTF=10 XTF=1 VJC=0.75 MJC=0.33)
TEXT 2896 1232 Left 2 !K1 L1 L2 L3 0.99
TEXT 3712 1760 Left 2 !.model 1N4755A D(Is=1.0u Rs=70 Bv=43 Ibv=5.8m Cjo=100p type=Zener)
TEXT 3720 1720 Left 2 !.model 1N5408 D(Is=63.0n Rs=14.1m Bv=1000 Ibv=10u Cjo=53p M=0.333 N=1.30 Eg=1.11)
TEXT -1384 2336 Left 2 !.param treble=0.5
TEXT -1384 2288 Left 2 !;.step param drive list 0 0.25 0.5 0.75 1.0\n.param drive=0.0
TEXT -1384 2368 Left 2 !.param bass=0.5
TEXT -1384 2400 Left 2 !.param vol=1.0
TEXT -1368 2952 Left 2 !.param in_amplitude = 0.1 ; 150 mVp = nuestro target P90
TEXT -1368 2984 Left 2 !.param in_freq=1000
TEXT -1384 2528 Left 2 !.options plotwinsize=0
TEXT -1368 3096 Left 2 !.param t_start = 4000m\n.param tran_window = 200m\n.param t_stop = {t_start + tran_window}\n.param step = 1 / {1000 * in_freq}\n.tran {step} {t_stop} {t_start} {step}
TEXT 6232 3296 Left 2 ;https://www.duncanamps.com/spice/loudspeakers/vint30.inc
TEXT -1360 3384 Left 2 !* ====================================================================\n* 🎸 COMPREHENSIVE GUITAR AMP DIAGNOSTICS (PREAMP & POWER AMP)\n* Topology change: Q9 removed. Q11 is now a standalone emitter follower\n* (TONE_OUT → C21 → Q11B; new bias divider 330k/110k; P3 master vol at output).\n* ====================================================================\n* --- 1. POWER SUPPLY RAILS & RIPPLE ---\n* Checks if the filter caps (C13, etc.) are sufficiently sizing down the AC ripple.\n.meas tran Vcc_mean AVG V(VCC)\n.meas tran Vcc_max MAX V(VCC)\n.meas tran Vcc_min MIN V(VCC)\n.meas tran Vcc_ripple PARAM (Vcc_max-Vcc_min)\n.meas tran Vraw_mean AVG V(N002)\n.meas tran Vraw_max MAX V(N002)\n.meas tran Vraw_min MIN V(N002)\n.meas tran Vraw_ripple PARAM (Vraw_max-Vraw_min)\n* --- 2. DC OPERATING POINTS (BIASING) ---\n* Verifies transistors aren't saturated/cutoff. The script will use these to calculate Vbe and Vce.\n* Preamp Transistors (Q8, Q10, Q11, Q12)   ; Q9 removed\n.meas tran Vq12b_mean AVG V(Q12B)\n.meas tran Vq12e_mean AVG V(Q12E)\n.meas tran Vq10b_mean AVG V(Q10B)\n.meas tran Vq10e_mean AVG V(Q10E)\n.meas tran Vq8b_mean  AVG V(Q8B)\n.meas tran Vq8e_mean  AVG V(Q8E)\n.meas tran Vq11b_mean AVG V(Q11B)         ; target ~12.2 V (new divider)\n.meas tran Vq11e_mean AVG V(Q11E)         ; target ~11.55 V (Vbe ≈ 0.65 V)\n* Power Amp Transistors (Q1-Q7)\n.meas tran Vq1b_mean AVG V(Q1B)\n.meas tran Vq1e_mean AVG V(Q1E)\n.meas tran Vq2b_mean AVG V(Q2B)\n* Vq2e_mean removed: Q2 emitter is hardwired to GND (would always FAIL).\n.meas tran Vq2c_mean AVG V(Q2C)\n.meas tran Vq6b_mean AVG V(Q6B)\n.meas tran Vq6c_mean AVG V(Q6C)           ; ADDED — needed by Vce_Q4 below\n.meas tran Vq6e_mean AVG V(Q6E)\n.meas tran Vq7b_mean AVG V(Q7B)\n.meas tran Vq7c_mean AVG V(Q7C)\n* --- 3. SIGNAL LEVELS & HEADROOM (MAX/MIN/RMS) ---\n* Detects clipping limits. PRE_SPEAKER should center exactly at VCC/2.\n.meas tran Vpickup_in_max MAX V(PICKUP_IN)\n.meas tran Vpickup_in_min MIN V(PICKUP_IN)\n.meas tran Vpickup_in_rms RMS V(PICKUP_IN)\n.meas tran Vtone_in_max MAX V(TONE_IN)\n.meas tran Vtone_in_min MIN V(TONE_IN)\n.meas tran Vtone_in_rms RMS V(TONE_IN)\n.meas tran Vtone_out_max MAX V(TONE_OUT)\n.meas tran Vtone_out_min MIN V(TONE_OUT)\n.meas tran Vtone_out_rms RMS V(TONE_OUT)\n* NEW: Q11 buffer headroom monitoring (Q11 now sees full TONE_OUT swing)\n.meas tran Vq11b_max MAX V(Q11B)\n.meas tran Vq11b_min MIN V(Q11B)\n.meas tran Vq11b_rms RMS V(Q11B)\n.meas tran Vq11e_max MAX V(Q11E)\n.meas tran Vq11e_min MIN V(Q11E)\n.meas tran Vq11e_rms RMS V(Q11E)\n.meas tran Vpreamp_out_max MAX V(PREAMP_OUT)\n.meas tran Vpreamp_out_min MIN V(PREAMP_OUT)\n.meas tran Vpreamp_out_rms RMS V(PREAMP_OUT)\n.meas tran Vpre_speaker_max  MAX V(PRE_SPEAKER)\n.meas tran Vpre_speaker_min  MIN V(PRE_SPEAKER)\n.meas tran Vpre_speaker_mean AVG V(PRE_SPEAKER)\n.meas tran Vpre_speaker_rms  RMS V(PRE_SPEAKER)\n.meas tran Vspeaker_max MAX V(SPEAKER)\n.meas tran Vspeaker_min MIN V(SPEAKER)\n.meas tran Vspeaker_rms RMS V(SPEAKER)\n* --- 4. GAIN STAGING ---\n* Tracks the AC voltage multiplication at every block. Uses peak-to-peak to ignore DC offsets.\n.meas tran Gain_Pre_Stage1 PARAM (Vtone_in_max-Vtone_in_min)/(Vpickup_in_max-Vpickup_in_min)\n.meas tran ToneStack_Loss  PARAM (Vtone_out_max-Vtone_out_min)/(Vtone_in_max-Vtone_in_min)\n* NEW: decomposed Stage 2 (was Q9+Q11+P3, now just Q11 follower + P3)\n.meas tran Buffer_Gain_Q11 PARAM (Vq11e_max-Vq11e_min)/(Vq11b_max-Vq11b_min)   ; expect ≈ 0.99\n.meas tran MasterVol_Atten PARAM (Vpreamp_out_max-Vpreamp_out_min)/(Vq11e_max-Vq11e_min)\n* Aggregate kept for backward comparison with old logs:\n.meas tran Gain_Pre_Stage2  PARAM (Vpreamp_out_max-Vpreamp_out_min)/(Vtone_out_max-Vtone_out_min)\n.meas tran Gain_Total_Preamp PARAM (Vpreamp_out_max-Vpreamp_out_min)/(Vpickup_in_max-Vpickup_in_min)\n.meas tran Gain_PowerAmp     PARAM (Vspeaker_max-Vspeaker_min)/(Vpreamp_out_max-Vpreamp_out_min)\n.meas tran Gain_System_Total PARAM (Vspeaker_max-Vspeaker_min)/(Vpickup_in_max-Vpickup_in_min)\n* --- 5. DISTORTION, SYMMETRY & RINGING ---\n* .four checks for harmonic distortion. Excessive high-order harmonics often indicate parasitic oscillation/ringing.\n* Symmetry variables >1.05 or <0.95 indicate asymmetric clipping.\n.meas tran Clip_Sym_Preamp PARAM abs(Vpreamp_out_max/Vpreamp_out_min)\n.meas tran Clip_Sym_Power  PARAM abs(Vspeaker_max/Vspeaker_min)\n.four {in_freq} 15 10 V(PREAMP_OUT)\n.four {in_freq} 15 10 V(PRE_SPEAKER)\n.four {in_freq} 15 10 V(SPEAKER)\n* Transient timing checks (Sharp spikes/ringing will disrupt these triggers, acting as a stability flag)\n.meas tran Rise_Time TRIG V(SPEAKER)=0.1*Vspeaker_max RISE=1 TARG V(SPEAKER)=0.9*Vspeaker_max RISE=1\n.meas tran Fall_Time TRIG V(SPEAKER)=0.9*Vspeaker_min FALL=1 TARG V(SPEAKER)=0.1*Vspeaker_min FALL=1\n* --- 6. QUIESCENT CURRENTS & POWER DRAW ---\n* Ensures the output stage bias isn't drifting into thermal runaway (Target: ~40mA per your schematic notes).\n.meas tran I_Supply_mean AVG I(V2)\n.meas tran Power_Total_W PARAM abs(I_Supply_mean*47)\n.meas tran Iq6_bias AVG I(R16)\n.meas tran Iq7_bias AVG I(R17)\n.meas tran Output_Bias_mA PARAM abs(Iq6_bias)*1000\n* --- 7. RIPPLE & AC MAINS INTRUSION (50Hz Base) ---\n* Evaluates how much mains hum/ripple reaches the audio path\n.four 50 10 2 V(N002)\n.four 50 10 2 V(VCC)\n.four 50 10 2 V(PREAMP_OUT)\n.four 50 10 2 V(SPEAKER)\n.meas tran Iq_R16_real AVG I(R16) FROM 100m TO 200m\n.meas tran Iq_R17_real AVG I(R17) FROM 100m TO 200m\n.meas tran Iq_through_output PARAM (abs(Iq_R16_real)+abs(Iq_R17_real))/2*1000\n* Vbe / Vce sanity checks\n.meas tran Vbe_Q6  PARAM Vq6b_mean - Vq6e_mean\n.meas tran Vbe_Q7  PARAM Vq7b_mean                  ; FIXED: Q7 emitter is GND, so Vbe = V(Q7B)\n.meas tran Vbe_Q11 PARAM Vq11b_mean - Vq11e_mean    ; ADDED: target ≈ 0.65 V\n.meas tran Vce_Q4  PARAM Vq6c_mean - Vq6b_mean      ; now resolves (Vq6c_mean added in §2)\n.meas tran Vce_Q5  PARAM Vq7b_mean - Vq7c_mean\n* Tone-stack diode clipper diagnostics\n.meas tran Vtone_in_pk_pos MAX V(TONE_IN)\n.meas tran Vtone_in_pk_neg MIN V(TONE_IN)\n.meas tran diode_clip_pos PARAM (Vtone_in_pk_pos > 1.35)\n.meas tran diode_clip_neg PARAM (Vtone_in_pk_neg < -1.95)\n.meas tran Speaker_RMS_power AVG abs(V(SPEAKER)*I(R27))
TEXT 4072 1136 Left 2 ;Note that Vcc is disconnected: will be used just for debug purposes, to simulate an ideal power supply unit.

The netlist it stands for:
* AudioAmpCompl-40W.asc
Q6 Q6C Q6B Q6E 0 2SD896
Q7 Q7C Q7B 0 0 2SD896
R16 Q6E X 0.5
R17 X Q7C 0.5
Q4 Q6C Q4B Q6B 0 BD139
R14 Q6B X 56
R15 Q7B 0 56
Q5 Q7B Q5B Q5E 0 BD140
R12 Q4B Q3C 470
R13 Q5B Q3E 470
Q3 Q3C Q3B Q3E 0 BD139
R7 Q3C N010 2k2
R8 N011 Q3E 1k
C6 Q3C Q3E 10n
R10 BOOTSTRAP Q3C 2k7
R9 N008 BOOTSTRAP 1k
C8 BOOTSTRAP X 33µ
C9 X N015 100n
R18 N015 0 10
R11 Q3E N024 220
C7 N024 0 330p
Q2 Q3E Q1C 0 0 BD139
R6 Q1C 0 1k
C5 Q1C 0 10n
Q1 Q1C Q1B Q1E 0 BC556B
R5 X Q1E 4k7
R2 N009 N008 1k
C3 N009 0 3µ3
R3 N009 Q1B 150k
R4 FEEDBACK 0 47
C10 SPEAKER X 3300µ
C4 Q1E FEEDBACK 150µ
V2 Q6C 0 15
C2 Q1B 0 150p
C1 N017 PREAMP_OUT 1µ
R1 Q1B N017 1k
R19 SPEAKER FEEDBACK 2k2
C12 N009 Q1B 22p
C11 Q3E Q1C 100p
V4 N004 N005 SINE(0 325 50) Rser=0.1
L1 N004 P001 10H
L2 N003 P002 0.275H
L3 N006 N007 0.010H
R22 P001 N005 15
R23 P002 N001 0.5
D1 N001 N002 1N5408
D2 N003 N002 1N5408
D3 0 N003 1N5408
D4 0 N001 1N5408
C13 N002 P003 10000µ
R24 P003 0 0.03
R25 N006 N007 1k
R26 Q6C N008 47
C14 N008 0 1000µ
R27 0002 SPEAKER 7.5
R28 0003 0002 12.5
L4 0003 0002 20m
C15 0003 0002 250µ
R29 0004 0003 0.5
C16 0004 0003 50µ
L5 0004 0003 100µ
R30 0 0004 20
L6 0 0004 100µ
R31 VRAW+ N002 0.001
Q8 Q10B Q8B Q8E 0 BC546B
C17 Q10C Q10B 47p
C18 MID_IN Q10C 1µ
R32 Q10C Q8E 610
R33 Q12C Q8_BIAS 56k
R34 Q12C Q10B 2K2
R35 TONE_IN MID_IN 470
R36 Q8E 0 330
R37 N020 N019 47
C19 N012 TONE_IN 15n
C20 N020 0 470n
C21 Q11B TONE_OUT 1µ
R40 Q8_BIAS 0 22k
Q10 Q10C Q10B Q12C 0 BC556B
C22 Q8_BIAS 0 47µ
R42 Q8_BIAS Q8B 220K
R43 TONE_IN N018 10k
R44 N025 0 100
R45 N016 N020 47
R46 MID_IN 0 47k
R47 VRAW+ Q11C 100
C23 Q11C 0 470µ
V6 PICKUP_IN 0 SINE(0 {in_amplitude} {in_freq})
C25 P004 Q8E 47µ
R49 N023 P004 22
Q11 Q11C Q11B Q11E 0 BC546B
R50 Q11E 0 10k
R51 VRAW+ Q12C 100
C27 Q12C 0 470µ
Q12 Q12C Q12B Q12E 0 BC546B
R52 PICKUP_OUT 0 10Meg
C28 P005 PICKUP_OUT 1µ
R53 Q12B P005 1k
R54 Q12E 0 10k
R55 Q12C Q12_BIAS 120k
R56 Q12_BIAS 0 200k
R57 Q12B Q12_BIAS 120k
C29 Q12E Q12_BIAS 4µ7
C30 Q12B Q12E 1n
C31 Q8B Q12E 1µ
D5 TONE_IN N022 1N4148
D6 N022 0 1N4148
D7 N021 TONE_IN 1N4148
D8 0 N026 1N4148
XRV2 N010 N011 Q3B linear_pot Rtot=1K wiper=.037  ; pins A B C
XRV1 Q1B FEEDBACK FEEDBACK linear_pot Rtot=250K wiper=.54  ; pins A B C
XP2 N012 N016 TONE_OUT linear_pot Rtot=10K wiper={treble}  ; pins A B C
XP1 N018 N025 N019 linear_pot Rtot=10K wiper={bass}  ; pins A B C
XP3 N013 0 PREAMP_OUT log_pot Rtot=10K wiper={vol}  ; pins A B C
XP4 N023 0 0 revlog_pot Rtot=1K wiper={drive}  ; pins A B C
D9 N026 N021 1N4148
L7 PICKUP_IN N014 2.2
R58 PICKUP_OUT N014 5.8k
R60 0 PICKUP_OUT 250k
R61 0 PICKUP_OUT 250k
C34 PICKUP_OUT 0 500p
R62 PICKUP_OUT 0 1000k
C32 0 PICKUP_OUT 120p
R20 Q6C 0 1G
R21 N005 0 1G
R59 N007 0 1G
C24 N013 Q11E 1µ
R38 Q11C Q11B 330k
R48 Q11B 0 110K
C26 Q11B 0 100p
D10 Q7C Q5E 1N4007
.model D D
.lib standard.dio
.model NPN NPN
.model PNP PNP
.lib standard.bjt
* RV1: Adjust so that voltage at OUTPUT is 1/2 of VCC
* RV2: Adjust for 40mA quiescent current through R16/R17.
.MODEL BD139 NPN(IS=2.3985E-13 BF=244.9 NF=1.0 BR=78.11 NR=1.007 ISE=1.0471E-14
+ NE=1.2 ISC=1.9314E-11 NC=1.45 VAF=98.5 VAR=7.46 IKF=1.1863 IKR=0.1445 RB=2.14
+ RBM=0.001 IRB=0.031 RE=0.0832 RC=0.01 CJE=2.92702E-10 VJE=0.67412 MJE=0.3300
+ FC=0.5 CJC=4.8831E-11 VJC=0.5258 MJC=0.3928 XCJC=0.5287 XTB=1.1398 EG=1.2105 XTI=3.0)
.MODEL BD140 PNP(IS=1.408E-13 BF=163.6 NF=1.0 BR=42.79 NR=1.0 ISE=3.58E-14
+ NE=1.5 ISC=4.093E-11 NC=1.45 VAF=64.2 VAR=100 IKF=1.077 IKR=0.2 RB=1.98
+ RBM=0.001 IRB=0.024 RE=0.063 RC=0.01 CJE=3.045E-10 VJE=0.697 MJE=0.344
+ FC=0.5 CJC=6.78E-11 VJC=0.526 MJC=0.404 XCJC=0.528 XTB=1.35 EG=1.21 XTI=3.0)
.MODEL 2SD896 NPN(IS=1e-11 BF=120 VAF=100 IKF=5 ISE=1e-11 NE=2 RB=2 RC=0.1 RE=0.05 CJC=340p CJE=1.5n TF=10.6n TR=1u ITF=2 VTF=10 XTF=1 VJC=0.75 MJC=0.33)
.MODEL 2SB776 PNP(IS=1e-11 BF=120 VAF=100 IKF=5 ISE=1e-11 NE=2 RB=2 RC=0.1 RE=0.05 CJC=480p CJE=2n TF=10.6n TR=1u ITF=2 VTF=10 XTF=1 VJC=0.75 MJC=0.33)
K1 L1 L2 L3 0.99
.model 1N4755A D(Is=1.0u Rs=70 Bv=43 Ibv=5.8m Cjo=100p type=Zener)
.model 1N5408 D(Is=63.0n Rs=14.1m Bv=1000 Ibv=10u Cjo=53p M=0.333 N=1.30 Eg=1.11)
.param treble=0.5
;.step param drive list 0 0.25 0.5 0.75 1.0
.param drive=0.0
.param bass=0.5
.param vol=1.0
.param in_amplitude = 0.1 ; 150 mVp = nuestro target P90
.param in_freq=1000
.options plotwinsize=0
.param t_start = 4000m
.param tran_window = 200m
.param t_stop = {t_start + tran_window}
.param step = 1 / {1000 * in_freq}
.tran {step} {t_stop} {t_start} {step}
* https://www.duncanamps.com/spice/loudspeakers/vint30.inc
* ====================================================================
* 🎸 COMPREHENSIVE GUITAR AMP DIAGNOSTICS (PREAMP & POWER AMP)
* Topology change: Q9 removed. Q11 is now a standalone emitter follower
* (TONE_OUT → C21 → Q11B; new bias divider 330k/110k; P3 master vol at output).
* ====================================================================
* --- 1. POWER SUPPLY RAILS & RIPPLE ---
* Checks if the filter caps (C13, etc.) are sufficiently sizing down the AC ripple.
.meas tran Vcc_mean AVG V(VCC)
.meas tran Vcc_max MAX V(VCC)
.meas tran Vcc_min MIN V(VCC)
.meas tran Vcc_ripple PARAM (Vcc_max-Vcc_min)
.meas tran Vraw_mean AVG V(N002)
.meas tran Vraw_max MAX V(N002)
.meas tran Vraw_min MIN V(N002)
.meas tran Vraw_ripple PARAM (Vraw_max-Vraw_min)
* --- 2. DC OPERATING POINTS (BIASING) ---
* Verifies transistors aren't saturated/cutoff. The script will use these to calculate Vbe and Vce.
* Preamp Transistors (Q8, Q10, Q11, Q12)   ; Q9 removed
.meas tran Vq12b_mean AVG V(Q12B)
.meas tran Vq12e_mean AVG V(Q12E)
.meas tran Vq10b_mean AVG V(Q10B)
.meas tran Vq10e_mean AVG V(Q10E)
.meas tran Vq8b_mean  AVG V(Q8B)
.meas tran Vq8e_mean  AVG V(Q8E)
.meas tran Vq11b_mean AVG V(Q11B)         ; target ~12.2 V (new divider)
.meas tran Vq11e_mean AVG V(Q11E)         ; target ~11.55 V (Vbe ≈ 0.65 V)
* Power Amp Transistors (Q1-Q7)
.meas tran Vq1b_mean AVG V(Q1B)
.meas tran Vq1e_mean AVG V(Q1E)
.meas tran Vq2b_mean AVG V(Q2B)
* Vq2e_mean removed: Q2 emitter is hardwired to GND (would always FAIL).
.meas tran Vq2c_mean AVG V(Q2C)
.meas tran Vq6b_mean AVG V(Q6B)
.meas tran Vq6c_mean AVG V(Q6C)           ; ADDED — needed by Vce_Q4 below
.meas tran Vq6e_mean AVG V(Q6E)
.meas tran Vq7b_mean AVG V(Q7B)
.meas tran Vq7c_mean AVG V(Q7C)
* --- 3. SIGNAL LEVELS & HEADROOM (MAX/MIN/RMS) ---
* Detects clipping limits. PRE_SPEAKER should center exactly at VCC/2.
.meas tran Vpickup_in_max MAX V(PICKUP_IN)
.meas tran Vpickup_in_min MIN V(PICKUP_IN)
.meas tran Vpickup_in_rms RMS V(PICKUP_IN)
.meas tran Vtone_in_max MAX V(TONE_IN)
.meas tran Vtone_in_min MIN V(TONE_IN)
.meas tran Vtone_in_rms RMS V(TONE_IN)
.meas tran Vtone_out_max MAX V(TONE_OUT)
.meas tran Vtone_out_min MIN V(TONE_OUT)
.meas tran Vtone_out_rms RMS V(TONE_OUT)
* NEW: Q11 buffer headroom monitoring (Q11 now sees full TONE_OUT swing)
.meas tran Vq11b_max MAX V(Q11B)
.meas tran Vq11b_min MIN V(Q11B)
.meas tran Vq11b_rms RMS V(Q11B)
.meas tran Vq11e_max MAX V(Q11E)
.meas tran Vq11e_min MIN V(Q11E)
.meas tran Vq11e_rms RMS V(Q11E)
.meas tran Vpreamp_out_max MAX V(PREAMP_OUT)
.meas tran Vpreamp_out_min MIN V(PREAMP_OUT)
.meas tran Vpreamp_out_rms RMS V(PREAMP_OUT)
.meas tran Vpre_speaker_max  MAX V(PRE_SPEAKER)
.meas tran Vpre_speaker_min  MIN V(PRE_SPEAKER)
.meas tran Vpre_speaker_mean AVG V(PRE_SPEAKER)
.meas tran Vpre_speaker_rms  RMS V(PRE_SPEAKER)
.meas tran Vspeaker_max MAX V(SPEAKER)
.meas tran Vspeaker_min MIN V(SPEAKER)
.meas tran Vspeaker_rms RMS V(SPEAKER)
* --- 4. GAIN STAGING ---
* Tracks the AC voltage multiplication at every block. Uses peak-to-peak to ignore DC offsets.
.meas tran Gain_Pre_Stage1 PARAM (Vtone_in_max-Vtone_in_min)/(Vpickup_in_max-Vpickup_in_min)
.meas tran ToneStack_Loss  PARAM (Vtone_out_max-Vtone_out_min)/(Vtone_in_max-Vtone_in_min)
* NEW: decomposed Stage 2 (was Q9+Q11+P3, now just Q11 follower + P3)
.meas tran Buffer_Gain_Q11 PARAM (Vq11e_max-Vq11e_min)/(Vq11b_max-Vq11b_min)   ; expect ≈ 0.99
.meas tran MasterVol_Atten PARAM (Vpreamp_out_max-Vpreamp_out_min)/(Vq11e_max-Vq11e_min)
* Aggregate kept for backward comparison with old logs:
.meas tran Gain_Pre_Stage2  PARAM (Vpreamp_out_max-Vpreamp_out_min)/(Vtone_out_max-Vtone_out_min)
.meas tran Gain_Total_Preamp PARAM (Vpreamp_out_max-Vpreamp_out_min)/(Vpickup_in_max-Vpickup_in_min)
.meas tran Gain_PowerAmp     PARAM (Vspeaker_max-Vspeaker_min)/(Vpreamp_out_max-Vpreamp_out_min)
.meas tran Gain_System_Total PARAM (Vspeaker_max-Vspeaker_min)/(Vpickup_in_max-Vpickup_in_min)
* --- 5. DISTORTION, SYMMETRY & RINGING ---
* .four checks for harmonic distortion. Excessive high-order harmonics often indicate parasitic oscillation/ringing.
* Symmetry variables >1.05 or <0.95 indicate asymmetric clipping.
.meas tran Clip_Sym_Preamp PARAM abs(Vpreamp_out_max/Vpreamp_out_min)
.meas tran Clip_Sym_Power  PARAM abs(Vspeaker_max/Vspeaker_min)
.four {in_freq} 15 10 V(PREAMP_OUT)
.four {in_freq} 15 10 V(PRE_SPEAKER)
.four {in_freq} 15 10 V(SPEAKER)
* Transient timing checks (Sharp spikes/ringing will disrupt these triggers, acting as a stability flag)
.meas tran Rise_Time TRIG V(SPEAKER)=0.1*Vspeaker_max RISE=1 TARG V(SPEAKER)=0.9*Vspeaker_max RISE=1
.meas tran Fall_Time TRIG V(SPEAKER)=0.9*Vspeaker_min FALL=1 TARG V(SPEAKER)=0.1*Vspeaker_min FALL=1
* --- 6. QUIESCENT CURRENTS & POWER DRAW ---
* Ensures the output stage bias isn't drifting into thermal runaway (Target: ~40mA per your schematic notes).
.meas tran I_Supply_mean AVG I(V2)
.meas tran Power_Total_W PARAM abs(I_Supply_mean*47)
.meas tran Iq6_bias AVG I(R16)
.meas tran Iq7_bias AVG I(R17)
.meas tran Output_Bias_mA PARAM abs(Iq6_bias)*1000
* --- 7. RIPPLE & AC MAINS INTRUSION (50Hz Base) ---
* Evaluates how much mains hum/ripple reaches the audio path
.four 50 10 2 V(N002)
.four 50 10 2 V(VCC)
.four 50 10 2 V(PREAMP_OUT)
.four 50 10 2 V(SPEAKER)
.meas tran Iq_R16_real AVG I(R16) FROM 100m TO 200m
.meas tran Iq_R17_real AVG I(R17) FROM 100m TO 200m
.meas tran Iq_through_output PARAM (abs(Iq_R16_real)+abs(Iq_R17_real))/2*1000
* Vbe / Vce sanity checks
.meas tran Vbe_Q6  PARAM Vq6b_mean - Vq6e_mean
.meas tran Vbe_Q7  PARAM Vq7b_mean                  ; FIXED: Q7 emitter is GND, so Vbe = V(Q7B)
.meas tran Vbe_Q11 PARAM Vq11b_mean - Vq11e_mean    ; ADDED: target ≈ 0.65 V
.meas tran Vce_Q4  PARAM Vq6c_mean - Vq6b_mean      ; now resolves (Vq6c_mean added in §2)
.meas tran Vce_Q5  PARAM Vq7b_mean - Vq7c_mean
* Tone-stack diode clipper diagnostics
.meas tran Vtone_in_pk_pos MAX V(TONE_IN)
.meas tran Vtone_in_pk_neg MIN V(TONE_IN)
.meas tran diode_clip_pos PARAM (Vtone_in_pk_pos > 1.35)
.meas tran diode_clip_neg PARAM (Vtone_in_pk_neg < -1.95)
.meas tran Speaker_RMS_power AVG abs(V(SPEAKER)*I(R27))
* Note that Vcc is disconnected: will be used just for debug purposes, to simulate an ideal power supply unit.
.lib linear_pot.sub
.lib log_pot.sub
.lib revlog_pot.sub
.backanno
.end